# Altium schematic sheet RR_MXR_v1.SchDoc
size A4; SheetNumber: 6; SheetTotal: 13
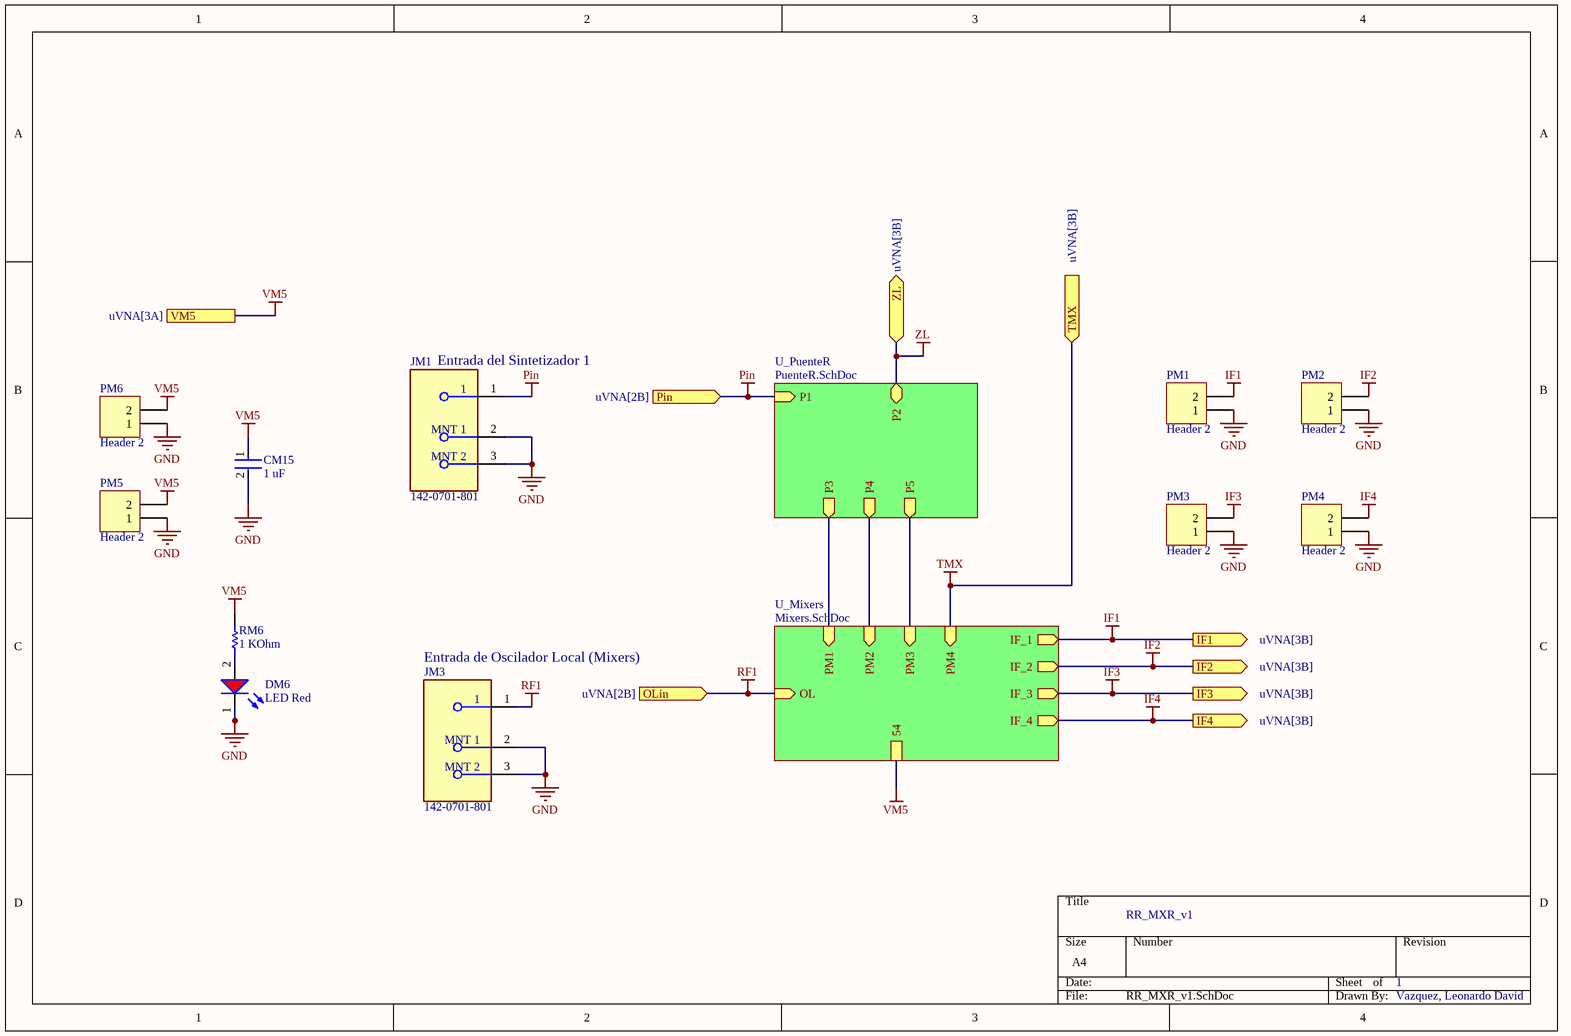
[diagram p0: RR_MXR_v1.SchDoc]

## Parts
CM15  1 uF  [FP-CC0805-0_85-MFG]
DM6  LED Red  [WL-SMCW_0805_150080xx75000]
JM1  142-0701-801  [FP-142-0701-801-MFG]
JM3  142-0701-801  [FP-142-0701-801-MFG]
PM1  Header 2  [HDR1X2]
PM2  Header 2  [HDR1X2]
PM3  Header 2  [HDR1X2]
PM4  Header 2  [HDR1X2]
PM5  Header 2  [HDR1X2]
PM6  Header 2  [HDR1X2]
RM6  1 KOhm  [RESC2013X60X40ML20T25]

## Sub-sheets
U_Mixers = Mixers.SchDoc: OL (in), PM4 (in), PM3 (in), PM2 (in), PM1 (in), IF_1 (out), IF_2 (out), IF_3 (out), IF_4 (out), 54
U_PuenteR = PuenteR.SchDoc: P1 (in), P2 (bidir), P4 (out), P5 (out), P3 (out)

## Ports
IF1 (out, see uVNA[3B]), IF2 (out, see uVNA[3B]), IF3 (out, see uVNA[3B]), IF4 (out, see uVNA[3B]), OLin (in, see uVNA[2B]), Pin (in, see uVNA[2B]), TMX (in, see uVNA[3B]), VM5 (see uVNA[3A]), ZL (bidir, see uVNA[3B])

## Nets
GND: CM15.2 DM6.1(K) JM1.2(MNT_1) JM1.3(MNT_2) JM3.2(MNT_1) JM3.3(MNT_2) PM1.1 PM2.1 PM3.1 PM4.1 PM5.1 PM6.1
IF1: PM1.2 ; port IF1, sheet U_Mixers/IF_1
IF2: PM2.2 ; port IF2, sheet U_Mixers/IF_2
IF3: PM3.2 ; port IF3, sheet U_Mixers/IF_3
IF4: PM4.2 ; port IF4, sheet U_Mixers/IF_4
Pin: JM1.1 ; port Pin, sheet U_PuenteR/P1
RF1: JM3.1 ; port OLin, sheet U_Mixers/OL
TMX: port TMX, sheet U_Mixers/PM4
VM5: CM15.1 PM5.2 PM6.2 RM6.2 ; port VM5, sheet U_Mixers/54
ZL: port ZL, sheet U_PuenteR/P2
NetDM6_2: DM6.2(A) RM6.1
(unnamed): sheet U_PuenteR/P4, sheet U_Mixers/PM2
(unnamed): sheet U_PuenteR/P5, sheet U_Mixers/PM3
(unnamed): sheet U_PuenteR/P3, sheet U_Mixers/PM1

## Notes on the sheet
- (near JM1) Entrada del Sintetizador 1
- (near JM3) Entrada de Oscilador Local (Mixers)
- RR_MXR_v1
- 1
- Vazquez, Leonardo David

## Library data of the parts
CM15 = CMP-2100-03606-3: CAP CER 0.1UF 50V X7R 0805; Manufacturer Part Number: CC0805KRX7R9BB104; Manufacturer: Yageo; Tolerance: 0.1; Capacitance: 100 nF; Value: 100 nF; Device Class L1: Passive Components; ComponentLink2Description: Datasheet; Package: CC0805-0.85; Digikey Description: CAP CER 0.1UF 50V X7R 0805; Device Class L3: Ceramic Capacitors; Temperature: -30°C to +85°C; Temperature Characteristic: X7R; Voltage Rating: 50 V; Height: 0.95mm; RoHS: TRUE; Ipc Land Pattern Name: CAPC200125X85; Device Class L2: Capacitors; Category: Cap; Temperature Range Low: -30°C; Temperature Range High: +85°C; Material: Ceramic; Mouser Description: Multilayer Ceramic Capacitors MLCC - SMD/SMT 100nF 50V X7R 10%; Footprint Url: http://www.yageo.com/exep/pages/download/literatures/UPY-C_GEN_24.pdf; Automotive: No; Octopart: https://octopart.com/cc0805krx7r9bb104-yageo-192993; Lead Free: Yes; ComponentLink2URL: http://www.yageo.com/documents/recent/UPY-GPHC_Y5V_6.3V-to-50V_8.pdf
DM6 = CMP-1426-00011-2: NexarPartId: 29717781; Peak Wavelength: 630nm; Wavelength: 625nm; Viewing Angle: 140°; Test Current: 20mA; Forward Voltage: 2V; Forward Current: 100mA; Lens Style: Clear, Rectangular; Luminous Intensity: 150mcd; Max Reverse Voltage (DC): 5V; Length: 2mm; Case Code (Imperial): 0805; RoHS: Compliant; Max Operating Temperature: 85°C; Height: 700µm; Packaging: Tape and Reel; Color: Red; Case/Package: 0805; REACH SVHC: Unknown; Dominant Wavelength: 625nm; Min Operating Temperature: -40°C; Case Code (Metric): 2012; Mount: Surface Mount; Width: 1.25mm
JM1 JM3 = CMP-09588-000002-1: CONN SMA JACK STR 50OHM EDGE MNT; Frequency: 18GHz; Operating Frequency: 0 to 18 GHz; Body Material: Brass; Impedance: 50R; Voltage Rating: 335V; Gender: Female; Body Plating: Gold; Orientation: Straight; Length: 0.44inch; Max Operating Temperature: 165°C; Package Quantity: 5; Packaging: Bulk; Series: SMA; Contact Material: Copper; Min Operating Temperature: -65°C; Depth: 25.58mm; RoHS Compliant: Yes; Case/Package: SMA; Max Frequency: 18GHz; Radiation Hardening: No; Contact Plating: Gold; Mount: Edge; Connector Type: SMA; Fastening Type: Threaded; Termination: Solder
PM1-PM6 = Header 2: Header, 2-Pin; LatestRevisionDate: 17-Jul-2002; LatestRevisionNote: Re-released for DXP Platform.; Publisher: Altium Limited
RM6 = CMP-2001-00580-1: Manufacturer: Panasonic; Part Number: ERA6AEB101V